# Altium project DieuKhien_PRJ.PrjPcb
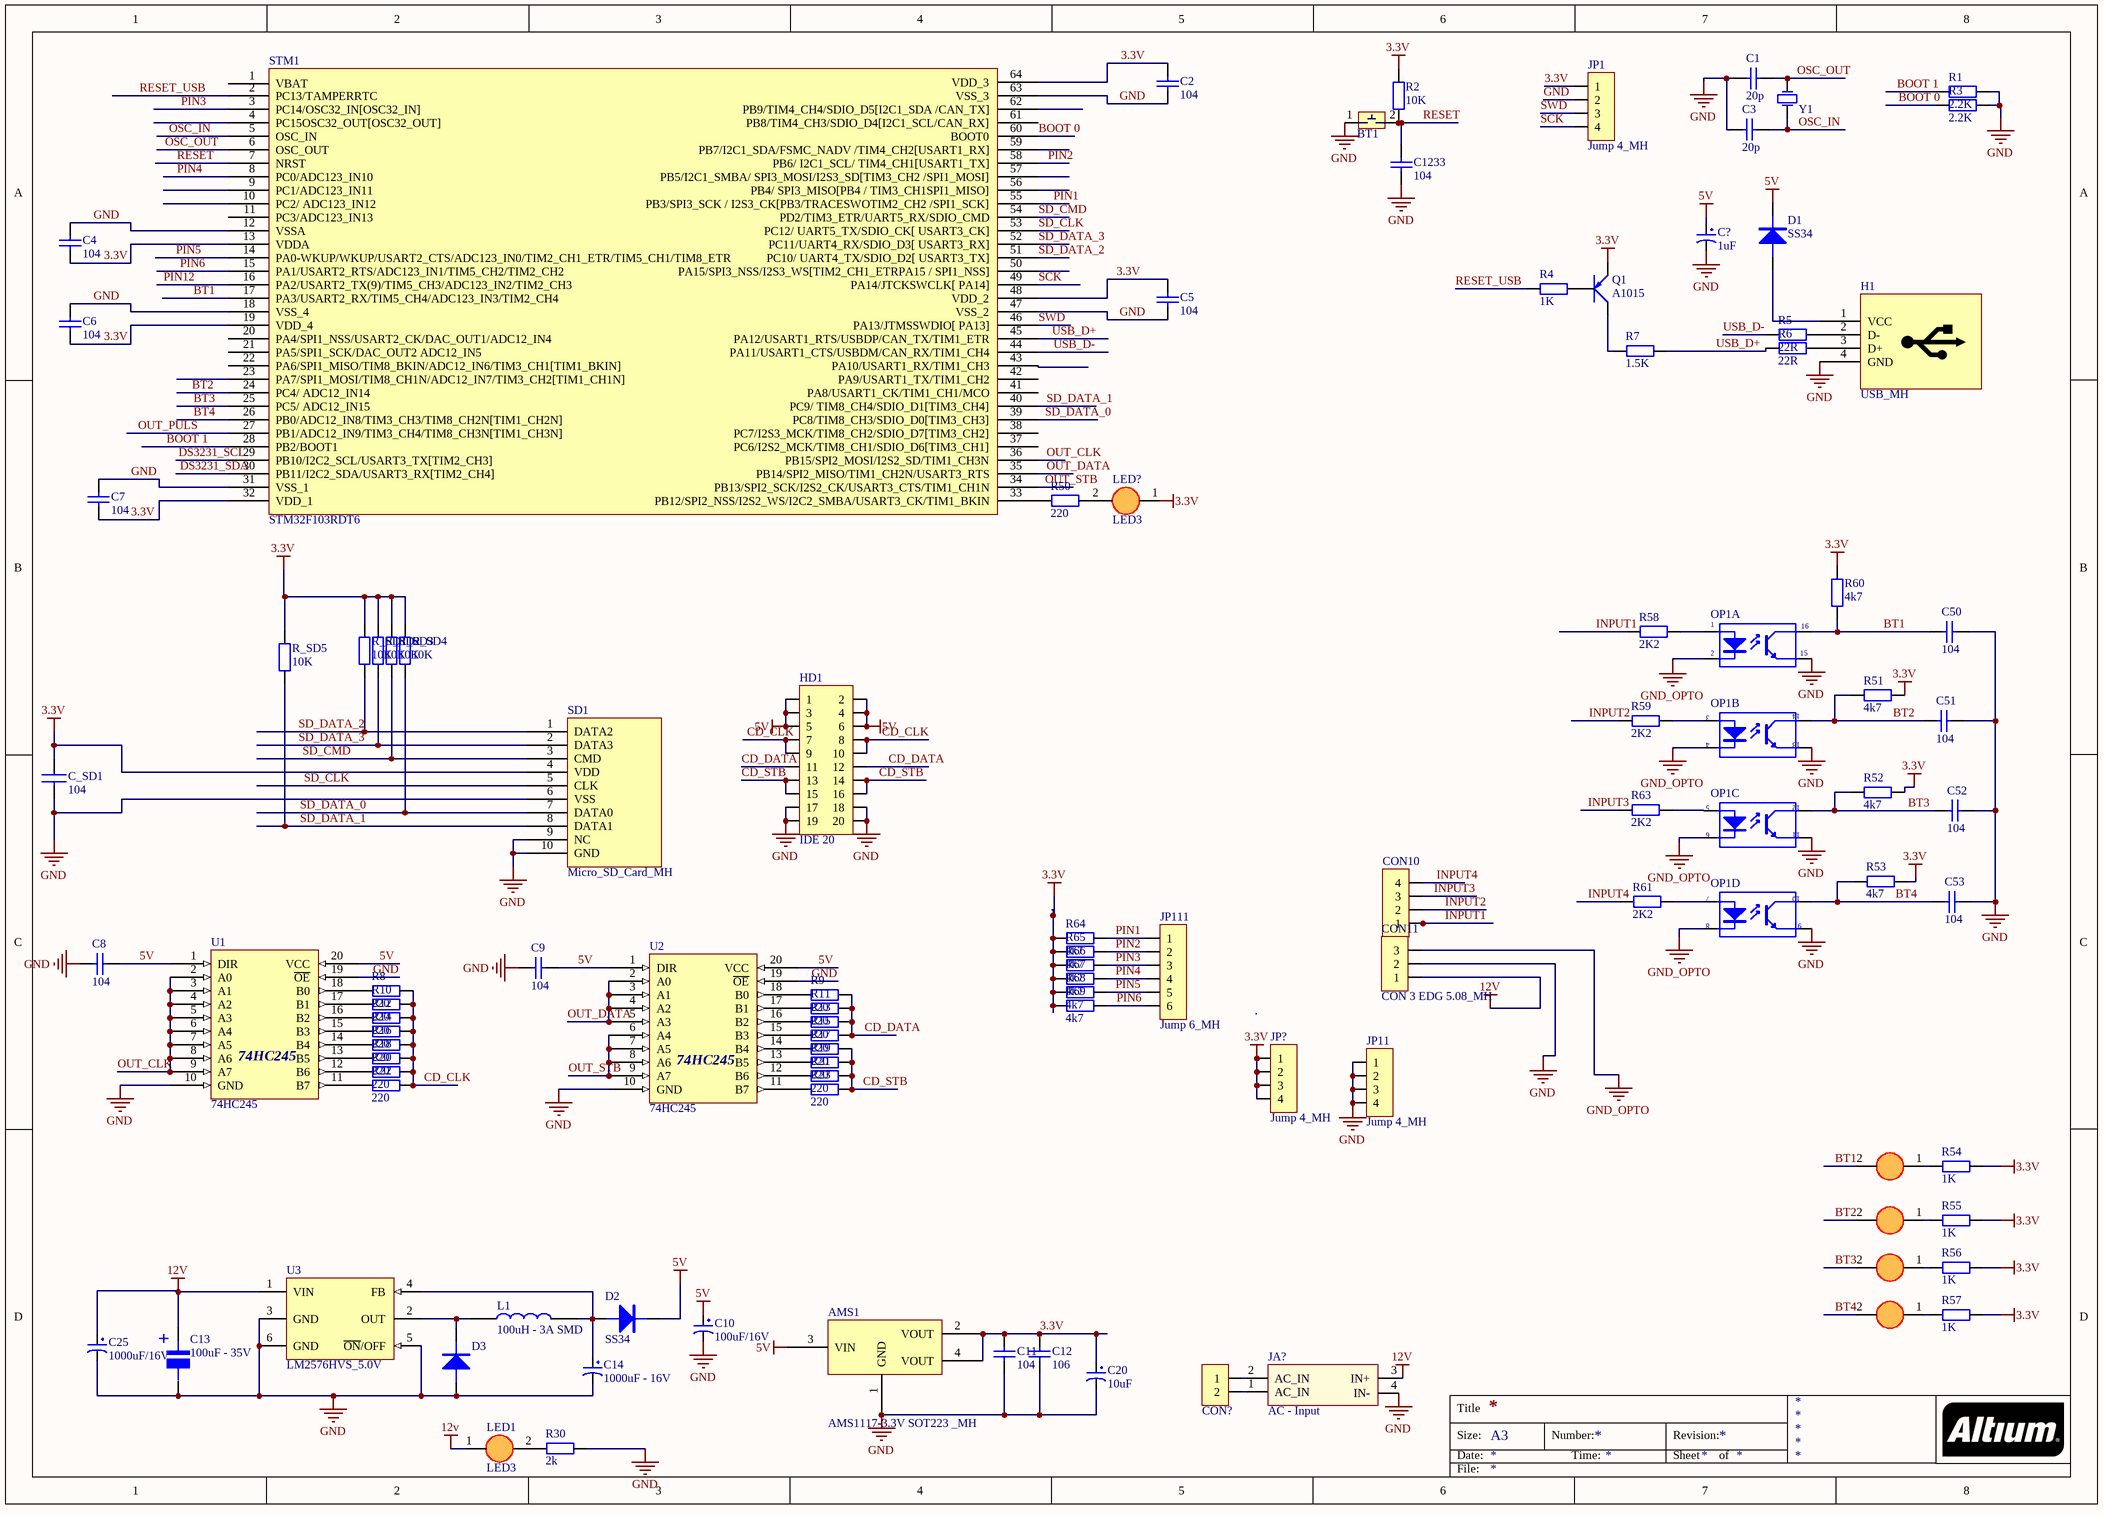
[diagram p0: DieuKhien_SCH.SchDoc]
2 sheets, 109 parts. Net scope: global (net labels, ports and power ports of the same name join across sheets).
Board file: DieuKhien_PCB.PcbDoc
Sheets:
  DieuKhien_SCH.SchDoc
  Mo_rong.SchDoc

## Sheet DieuKhien_SCH.SchDoc
size A3

### Parts
AMS1  AMS1117-3.3V SOT223 _MH  [SOT223]
BT1  BUTTON 4P 6x6_MH  [BUTTON 4 PIN(6*6)]  (value not drawn)
C1  20p  [TU_SMD_0805]
C2  104  [TU_SMD_0805]
C3  20p  [TU_SMD_0805]
C4  104  [TU_SMD_0805]
C5  104  [TU_SMD_0805]
C6  104  [TU_SMD_0805]
C7  104  [TU_SMD_0805]
C8  104  [TU_SMD_0805]
C9  104  [TU_SMD_0805]
C10  100uF/16V  [TU_HOA(100uF/35V - 470uF/16V)]
C11  104  [TU_SMD_0805]
C12  106  [TU_SMD_0805]
C13  100uF - 35V  [TU_HOA(100uF/35V - 470uF/16V)]
C14  1000uF - 16V  [TU_HOA(1000uF/16V/25V)]
C20  10uF  [TU_HOA(1uF< 22uF/16>50V)]
C25  1000uF/16V  [CP2/5]
C50  104  [TU_SMD_0805]
C51  104  [TU_SMD_0805]
C52  104  [TU_SMD_0805]
C53  104  [TU_SMD_0805]
C1233  104  [TU_SMD_0805]
C?  1uF  [CP1/2]
C_SD1  104  [TU_SMD_0805]
CON10  CON 4 EDG 5.08_MH  [Con 4 EDG 5.08]  (value not drawn)
CON11  CON 3 EDG 5.08_MH  [Con 3 EDG 5.08]
CON?  CON 2 KF301_MH  [CON 2 KF301]  (value not drawn)
D1  SS34  [SOD80]
D2  SS34  [SOD80]
D3  SS34  [SOD80]  (value not drawn)
H1  USB_MH  [USB-B-STRANGE]
HD1  IDE 20  [CABLE 20]
JA?  AC - Input  [Nguon HiLink 5V]
JP1  Jump 4_MH  [Jump 4]
JP11  Jump 4_MH  [Jump 4]
JP111  Jump 6_MH  [Jump 6]
JP?  Jump 4_MH  [Jump 4]
L1  100uH - 3A SMD  [L100uH3A]
LED1  LED3  [LED 3mm Do]
LED2  LED3  [LED 3mm Do]  (value not drawn)
LED3  LED3  [LED 3mm Do]  (value not drawn)
LED4  LED3  [LED 3mm Do]  (value not drawn)
LED5  LED3  [LED 3mm Do]  (value not drawn)
LED?  LED3  [LED 3mm Do]
OP1  TLP521-4GB DIP16 _MH  [DIP16]  (value not drawn)  (parts A,B,C,D of 4)
Q1  A1015  [SOT23]
R1  2.2K  [Tro SMD 0805]
R2  10K  [Tro SMD 0805]
R3  2.2K  [Tro SMD 0805]
R4  1K  [Tro SMD 0805]
R5  22R  [Tro SMD 0805]
R6  22R  [Tro SMD 0805]
R7  1.5K  [Tro SMD 0805]
R8  220  [Tro SMD 0805]
R9  220  [Tro SMD 0805]
R10  220  [Tro SMD 0805]
R11  220  [Tro SMD 0805]
R12  220  [Tro SMD 0805]
R13  220  [Tro SMD 0805]
R14  220  [Tro SMD 0805]
R15  220  [Tro SMD 0805]
R16  220  [Tro SMD 0805]
R17  220  [Tro SMD 0805]
R18  220  [Tro SMD 0805]
R19  220  [Tro SMD 0805]
R20  220  [Tro SMD 0805]
R21  220  [Tro SMD 0805]
R22  220  [Tro SMD 0805]
R23  220  [Tro SMD 0805]
R30  2k  [Tro SMD 0805]
R50  220  [Tro SMD 0805]
R51  4k7  [Tro SMD 0805]
R52  4k7  [Tro SMD 0805]
R53  4k7  [Tro SMD 0805]
R54  1K  [Tro SMD 0805]
R55  1K  [Tro SMD 0805]
R56  1K  [Tro SMD 0805]
R57  1K  [Tro SMD 0805]
R58  2K2  [Tro SMD 0805]
R59  2K2  [Tro SMD 0805]
R60  4k7  [Tro SMD 0805]
R61  2K2  [Tro SMD 0805]
R63  2K2  [Tro SMD 0805]
R64  4k7  [Tro SMD 0805]
R65  4k7  [Tro SMD 0805]
R66  4k7  [Tro SMD 0805]
R67  4k7  [Tro SMD 0805]
R68  4k7  [Tro SMD 0805]
R69  4k7  [Tro SMD 0805]
R_SD1  10K  [Tro SMD 0805]
R_SD2  10K  [Tro SMD 0805]
R_SD3  10K  [Tro SMD 0805]
R_SD4  10K  [Tro SMD 0805]
R_SD5  10K  [Tro SMD 0805]
SD1  Micro_SD_Card_MH  [MicroSD_TF_V3]
STM1  STM32F103RDT6  [LQFP64]
U1  74HC245  [SOP_20M_127]
U2  74HC245  [SOP_20M_127]
U3  LM2576HVS_5.0V  [LM2576t]
Y1  8Mhz  [XT2]  (value not drawn)

### Nets
3.3V: AMS1.2(VOUT) AMS1.4(VOUT) C2.2 C4.1 C5.2 C6.1 C7.1 C11.2 C12.2 C20.1 C_SD1.1 JP1.1 JP?.1 JP?.2 JP?.3 JP?.4 LED?.1(A) Q1.2(E) R2.1 R51.2 R52.2 R53.2 R54.2 R55.2 R56.2 R57.2 R60.2 R64.1 R65.1 R66.1 R67.1 R68.1 R69.1 R_SD1.2 R_SD2.2 R_SD3.2 R_SD4.2 R_SD5.2 SD1.4(VDD) STM1.13(VDDA) STM1.19(VDD_4) STM1.32(VDD_1) STM1.48(VDD_2) STM1.64(VDD_3)
5V: AMS1.3(VIN) C8.1 C9.1 C10.1 C?.1 D1.2 D2.2 HD1.1 HD1.2 HD1.3 HD1.4 HD1.5 HD1.6 U1.1(DIR) U1.20(VCC) U2.1(DIR) U2.20(VCC)
12V: C13.1 C25.1 CON11.1 JA?.3(IN+) LED1.1(A) U3.1(VIN)
GND: AMS1.1(GND) BT1.1 C1.2 C2.1 C3.2 C4.2 C5.1 C6.2 C7.2 C8.2 C9.2 C10.2 C11.1 C12.1 C13.2 C14.2 C20.2 C25.2 C50.1 C51.1 C52.1 C53.1 C1233.1 C?.2 C_SD1.2 CON11.2 D3.1 H1.4(GND) HD1.17 HD1.18 HD1.19 HD1.20 JA?.4(IN-) JP1.2 JP11.1 JP11.2 JP11.3 JP11.4 OP1.9(E) OP1.11(E) OP1.13(E) OP1.15(E) R1.2 R3.2 R30.1 SD1.6(VSS) SD1.9(NC) SD1.10(GND) STM1.12(VSSA) STM1.18(VSS_4) STM1.31(VSS_1) STM1.47(VSS_2) STM1.63(VSS_3) U1.10(GND) U1.19(~{OE}) U2.10(GND) U2.19(~{OE}) U3.3(GND) U3.5(~{ON}/OFF) U3.6(GND)
GND_OPTO: CON11.3 OP1.2(K) OP1.4(K) OP1.6(K) OP1.8(K)
BOOT 0: R3.1 STM1.60(BOOT0)
BOOT 1: R1.1 STM1.28(PB2/BOOT1)
BT1: C50.2 LED2.2(K) OP1.16(C) R60.1 STM1.17(PA3/USART2_RX/TIM5_CH4/ADC123_IN3/TIM2_CH4)
BT2: C51.2 LED3.2(K) OP1.14(C) R51.1 STM1.24(PC4/_ADC12_IN14)
BT3: C52.2 LED4.2(K) OP1.12(C) R52.1 STM1.25(PC5/_ADC12_IN15)
BT4: C53.2 LED5.2(K) OP1.10(C) R53.1 STM1.26(PB0/ADC12_IN8/TIM3_CH3/TIM8_CH2N[TIM1_CH2N])
CD_CLK: HD1.7 HD1.8 HD1.9 HD1.10 R8.2 R10.2 R12.2 R14.2 R16.2 R18.2 R20.2 R22.2
CD_DATA: HD1.11 HD1.12 R9.2 R11.2 R13.2 R15.2
CD_STB: HD1.13 HD1.14 HD1.15 HD1.16 R17.2 R19.2 R21.2 R23.2
DS3231_SCL: STM1.29(PB10/I2C2_SCL/USART3_TX[TIM2_CH3])
DS3231_SDA: STM1.30(PB11/I2C2_SDA/USART3_RX[TIM2_CH4])
INPUT1: CON10.1 R58.1
INPUT2: CON10.2 R59.1
INPUT3: CON10.3 R63.1
INPUT4: CON10.4 R61.1
OSC_IN: C3.1 STM1.5(OSC_IN) Y1.1(OSC1)
OSC_OUT: C1.1 STM1.6(OSC_OUT) Y1.2(OSC2)
OUT_CLK: STM1.36(PB15/SPI2_MOSI/I2S2_SD/TIM1_CH3N) U1.2(A0) U1.3(A1) U1.4(A2) U1.5(A3) U1.6(A4) U1.7(A5) U1.8(A6) U1.9(A7)
OUT_DATA: STM1.35(PB14/SPI2_MISO/TIM1_CH2N/USART3_RTS) U2.2(A0) U2.3(A1) U2.4(A2) U2.5(A3)
OUT_PULS: STM1.27(PB1/ADC12_IN9/TIM3_CH4/TIM8_CH3N[TIM1_CH3N])
OUT_STB: STM1.34(PB13/SPI2_SCK/I2S2_CK/USART3_CTS/TIM1_CH1N) U2.6(A4) U2.7(A5) U2.8(A6) U2.9(A7)
PIN1: JP111.1 R64.2 STM1.55(PB3/SPI3_SCK_/_I2S3_CK[PB3/TRACESWOTIM2_CH2_/SPI1_SCK])
PIN2: JP111.2 R65.2 STM1.58(PB6/_I2C1_SCL/_TIM4_CH1[USART1_TX])
PIN3: JP111.3 R66.2 STM1.3(PC14/OSC32_IN[OSC32_IN])
PIN4: JP111.4 R67.2 STM1.8(PC0/ADC123_IN10)
PIN5: JP111.5 R68.2 STM1.14(PA0-WKUP/WKUP/USART2_CTS/ADC123_IN0/TIM2_CH1_ETR/TIM5_CH1/TIM8_ETR)
PIN6: JP111.6 R69.2 STM1.15(PA1/USART2_RTS/ADC123_IN1/TIM5_CH2/TIM2_CH2)
PIN12: STM1.16(PA2/USART2_TX(9)/TIM5_CH3/ADC123_IN2/TIM2_CH3)
RESET: BT1.2 C1233.2 R2.2 STM1.7(NRST)
RESET_USB: R4.1 STM1.2(PC13/TAMPERRTC)
SCK: JP1.4 STM1.49(PA14/JTCKSWCLK[_PA14])
SD_CLK: SD1.5(CLK) STM1.53(PC12/_UART5_TX/SDIO_CK[_USART3_CK])
SD_CMD: R_SD3.1 SD1.3(CMD) STM1.54(PD2/TIM3_ETR/UART5_RX/SDIO_CMD)
SD_DATA_0: R_SD4.1 SD1.7(DATA0) STM1.39(PC8/TIM8_CH3/SDIO_D0[TIM3_CH3])
SD_DATA_1: R_SD5.1 SD1.8(DATA1) STM1.40(PC9/_TIM8_CH4/SDIO_D1[TIM3_CH4])
SD_DATA_2: R_SD1.1 SD1.1(DATA2) STM1.51(PC10/_UART4_TX/SDIO_D2[_USART3_TX])
SD_DATA_3: R_SD2.1 SD1.2(DATA3) STM1.52(PC11/UART4_RX/SDIO_D3[_USART3_RX])
SWD: JP1.3 STM1.46(PA13/JTMSSWDIO[_PA13])
USB_D+: R6.1 R7.2 STM1.45(PA12/USART1_RTS/USBDP/CAN_TX/TIM1_ETR)
USB_D-: R5.1 STM1.44(PA11/USART1_CTS/USBDM/CAN_RX/TIM1_CH4)
NetC14_1: C14.1 D2.1 L1.2 U3.4(FB)
NetCON?_1: CON?.1 JA?.2(AC_IN)
NetCON?_2: CON?.2 JA?.1(AC_IN)
NetD1_1: D1.1 H1.1(VCC)
NetD3_2: D3.2 L1.1 U3.2(OUT)
NetH1_2: H1.2(D-) R5.2
NetH1_3: H1.3(D+) R6.2
NetLED1_2: LED1.2(K) R30.2
NetLED2_1: LED2.1(A) R54.1
NetLED3_1: LED3.1(A) R55.1
NetLED4_1: LED4.1(A) R56.1
NetLED5_1: LED5.1(A) R57.1
NetLED?_2: LED?.2(K) R50.2
NetOP1_1: OP1.1(A) R58.2
NetOP1_3: OP1.3(A) R59.2
NetOP1_5: OP1.5(A) R63.2
NetOP1_7: OP1.7(A) R61.2
NetQ1_1: Q1.1(B) R4.2
NetQ1_3: Q1.3(C) R7.1
NetR8_1: R8.1 U1.18(B0)
NetR9_1: R9.1 U2.18(B0)
NetR10_1: R10.1 U1.17(B1)
NetR11_1: R11.1 U2.17(B1)
NetR12_1: R12.1 U1.16(B2)
NetR13_1: R13.1 U2.16(B2)
NetR14_1: R14.1 U1.15(B3)
NetR15_1: R15.1 U2.15(B3)
NetR16_1: R16.1 U1.14(B4)
NetR17_1: R17.1 U2.14(B4)
NetR18_1: R18.1 U1.13(B5)
NetR19_1: R19.1 U2.13(B5)
NetR20_1: R20.1 U1.12(B6)
NetR21_1: R21.1 U2.12(B6)
NetR22_1: R22.1 U1.11(B7)
NetR23_1: R23.1 U2.11(B7)
NetR50_1: R50.1 STM1.33(PB12/SPI2_NSS/I2S2_WS/I2C2_SMBA/USART3_CK/TIM1_BKIN)

Not connected (* = marked no-connect by the designer): H1 5 6; STM1 1(VBAT) 4(PC15OSC32_OUT[OSC32_OUT]) 9(PC1/ADC123_IN11) 10(PC2/_ADC123_IN12) 11(PC3/ADC123_IN13) 20(PA4/SPI1_NSS/USART2_CK/DAC_OUT1/ADC12_IN4) 21(PA5/SPI1_SCK/DAC_OUT2_ADC12_IN5) 22(PA6/SPI1_MISO/TIM8_BKIN/ADC12_IN6/TIM3_CH1[TIM1_BKIN]) 23(PA7/SPI1_MOSI/TIM8_CH1N/ADC12_IN7/TIM3_CH2[TIM1_CH1N]) 37(PC6/I2S2_MCK/TIM8_CH1/SDIO_D6[TIM3_CH1]) 38(PC7/I2S3_MCK/TIM8_CH2/SDIO_D7[TIM3_CH2]) 41(PA8/USART1_CK/TIM1_CH1/MCO) 42(PA9/USART1_TX/TIM1_CH2) 43(PA10/USART1_RX/TIM1_CH3) 50(PA15/SPI3_NSS/I2S3_WS[TIM2_CH1_ETRPA15_/_SPI1_NSS]) 56(PB4/_SPI3_MISO[PB4_/_TIM3_CH1SPI1_MISO]) 57(PB5/I2C1_SMBA/_SPI3_MOSI/I2S3_SD[TIM3_CH2_/SPI1_MOSI]) 59(PB7/I2C1_SDA/FSMC_NADV_/TIM4_CH2[USART1_RX]) 61(PB8/TIM4_CH3/SDIO_D4[I2C1_SCL/CAN_RX]) 62(PB9/TIM4_CH4/SDIO_D5[I2C1_SDA_/CAN_TX])

### Notes on the sheet
- Title
- Size:
- Date:
- A3
- Number:
- Time:
- Revision:
- Sheet
- of
- File:
- (in symbol Tu Hoa 100uF 35V) +

### Library data of the parts
BT1 = BUTTON 4P 6x6_MH: Nút nhấn 4 chân, 6x6mm, cắm
C1-C9 C11 C12 C50-C53 C1233 = TU_SMD_0805_MH
C10 = TU_HOA_100uF_16V_MH: TU_HOA_100uF_16V; Value: 100uF/35V/50V; Description 1: 1000uF/6,3V - 470uF/16V - 330uF - 25V; Description 2: 220uF/35V - 100uF/50V - 63V - 4,7uF/200V; Description 3: 22uF => 33uF100V - 3,3uF => 4,7uF/250V; Description 4: 2,2uF =>3,3uF/350 - 2,2uF/400V - 1uF/450V
C13 = Tu Hoa 100uF 35V: Cắm; Ten_Linh_Kien: Tụ Hóa 100uF 35V 8x11MM; Ma_Hang: MH002807; Don_Vi: Con; Ghi_Chu: *; Kieu_Chan: *; Chung_Loai: Cắm
C14 = Tu Nhom 1000uF - 16V: Dán; Ten_Linh_Kien: Tụ Nhôm 1000uF 16V 10x10MM; Ma_Hang: MH004419; Don_Vi: Con; Kieu_Chan: *; Ghi_Chu: *; Chung_Loai: Dán
C20 = TU_HOA_4.7uF_50V_MH: Cap P  0,1uF < 22uF , 16 - 50V; Value: 10uF/50V; Description 1: 10 => 220uF/6,3V/10V - 10uF => 100uF/16V; Description 2: 0,1uF => 33uF/50V - 10uF => 22uF/63V; Description 3: 0,47uF => 10uF/100V
C25 = TU_HOA_1000uF/25V_MH: Description 5: 4,7uF>10uF/250V_3,3uF>10uF/400V - 2,2uF>4,7uF/450V; Description 1: 2200uF-3300uF/6,3V - 1000uF-2200uF/10V; Description 2: 1000uF/16V - 470uF => 1000uF/25V - 100uF/100V; Description 3: 330uF>470uF/35V_220uF>470uF/50V_10uF>22uF/250V; Description 4: 220uF => 330uF/63V - 10uF =>33uF/160 - 200V; Value: 1000uF/16V
C? = TU_HOA_1uF_50V_MH: TU_HOA_1uF_50V; Value: 10uF/50V; Description 1: 10 => 220uF/6,3V/10V - 10uF => 100uF/16V; Description 2: 0,1uF => 33uF/50V - 10uF => 22uF/63V; Description 3: 0,47uF => 10uF/100V
C_SD1 = CAP 0805: Right: 20; Bottom: 10
CON10 = CON 4 EDG 5.08_MH: CON 4 EDG 5.08 (xanh cong)
CON11 = CON 3 EDG 5.08_MH: CON 3 EDG 5.08 (xanh cong)
CON? = CON 2 KF301_MH: CON 2 KF301, 5.08mm
D1-D3 = Diode 1N4148 SOD80 450mA 100V ( LL34 1N4148 SMD)_MH: Diode 1N4148 SOD80 450mA 100V ( LL34 1N4148 SMD)
H1 = USB_MH: USB conector
HD1 = IDE 20: IDE header 20P
JA? = NGUON_MINI: Value: AC - Input
JP1 JP11 JP? = Jump 4_MH: Jump 4P 2.54
JP111 = Jump 6_MH: Jump 6P 2.54
L1 = CUON CAM 100uH_SMD: Dán; Don_Vi: Con; Ma_Hang: MH003999; Ten_Linh_Kien: Cuộn Cảm 100uH 7x7x4MM CD74; Ma_Hang: *; Kieu_Chan: *; Chung_Loai: Dán
LED1-LED5 = LED 3mm_MH: LED 3mm
LED? = LED SMD_0805_MH: LED 3mm
Q1 = A1015 SOT23 TRANS PNP 0.15A 50V ( SMD-BA)_MH
R1-R23 R30 R50-R61 R63-R69 = TRO_SMD_0805_MH: TRO_SMD_0805
R_SD1-R_SD5 = R1/4W: Resistor 1/4W; Value: R1/4W - 1K
STM1 = STM32F103RDT6 - LQFP64: Dán; Ma_Hang: MH004910; Ten_Linh_Kien: STM32F103RDT6 LQFP64; Don_Vi: Con; Kieu_Chan: *; Ghi_Chu: *; Chung_Loai: Dán
U1 U2 = 74HC245: Dán; Ten_Linh_Kien: 74HC245DW SSOP20 5.2MM; Don_Vi: Con; Ma_Hang: MH003571; Ghi_Chu: *; Kieu_Chan: *; Chung_Loai: Dán
U3 = LM2576HVS_5.0V: Dán; Ten_Linh_Kien: LM2576HVS-5.0V BUCK 5V 3A TO263-5; Don_Vi: Con; Ma_Hang: MH002362; Ghi_Chu: *; Kieu_Chan: *; Chung_Loai: Dán
Y1 = CRYSTAL_49S DIP_MH: Crystal Oscillator; Published: 8-Jun-2000; LatestRevisionDate: 17-Jul-2002; LatestRevisionNote: Re-released for DXP Platform.; PackageReference: R38; Publisher: Altium Limited
OP1 = TLP521-4GB DIP16 _MH: Value: TLP521-4

## Sheet Mo_rong.SchDoc
size A
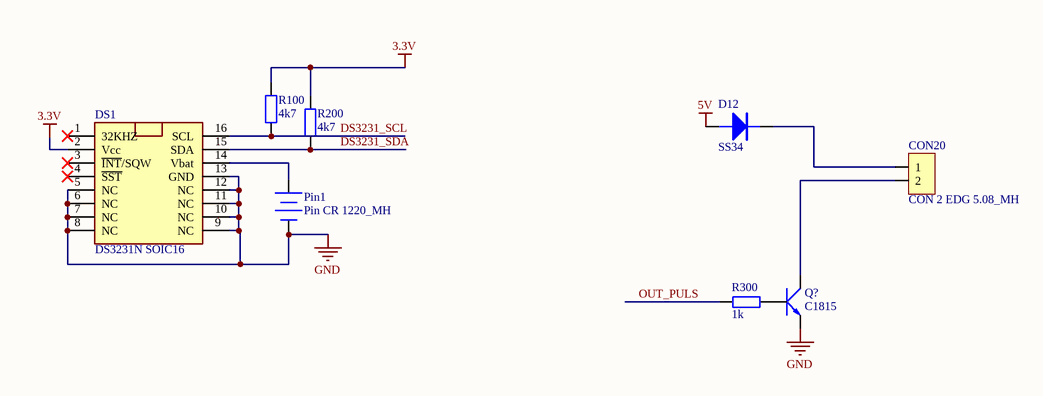
[diagram p1: Mo_rong.SchDoc]

### Parts
CON20  CON 2 EDG 5.08_MH  [CON 2 EDG 5.08]
D12  SS34  [SOD80]
DS1  DS3231N SOIC16  [SOIC16]
Pin1  Pin CR 1220_MH  [CR1220_MH]
Q?  C1815  [SOT23]
R100  4k7  [Tro SMD 0805]
R200  4k7  [Tro SMD 0805]
R300  1k  [Tro SMD 0805]

### Nets
3.3V: DS1.2(Vcc) R100.1 R200.1
5V: D12.1
GND: DS1.5(NC) DS1.6(NC) DS1.7(NC) DS1.8(NC) DS1.9(NC) DS1.10(NC) DS1.11(NC) DS1.12(NC) DS1.13(GND) Pin1.2(-) Q?.2(E)
DS3231_SCL: DS1.16(SCL) R100.2
DS3231_SDA: DS1.15(SDA) R200.2
OUT_PULS: R300.1
NetCON20_1: CON20.1 D12.2
NetCON20_2: CON20.2 Q?.3(C)
NetDS1_14: DS1.14(Vbat) Pin1.1(+)
NetQ?_1: Q?.1(B) R300.2

Not connected (* = marked no-connect by the designer): DS1 1(32KHZ)* 3(~{INT}/SQW)* 4(~{SST})*

### Library data of the parts
CON20 = CON 2 EDG 5.08_MH: CON 2 EDG 5.08 (xanh cong)
D12 = Diode 1N4148 SOD80 450mA 100V ( LL34 1N4148 SMD)_MH: as D1 on sheet DieuKhien_SCH
Pin1 = Pin CR 1220_MH: cr1220
Q? = C1815 SOT23 TRANS NPN 0.15A 50V (SMD-HF)_MH
R100 R200 R300 = TRO_SMD_0805_MH: TRO_SMD_0805

## Nets that join several sheets
3.3V: DieuKhien_SCH (44 pins), Mo_rong (DS1.2 R100.1 R200.1)
5V: DieuKhien_SCH (17 pins), Mo_rong (D12.1)
GND: DieuKhien_SCH (60 pins), Mo_rong (11 pins)
DS3231_SCL: DieuKhien_SCH (STM1.29), Mo_rong (DS1.16 R100.2)
DS3231_SDA: DieuKhien_SCH (STM1.30), Mo_rong (DS1.15 R200.2)
OUT_PULS: DieuKhien_SCH (STM1.27), Mo_rong (R300.1)